# Altium schematic sheet BlindZer_Sche.SchDoc: BlindZer
size A; DrawnBy: Can Chen; Revision: -; SheetNumber: 1; SheetTotal: 1
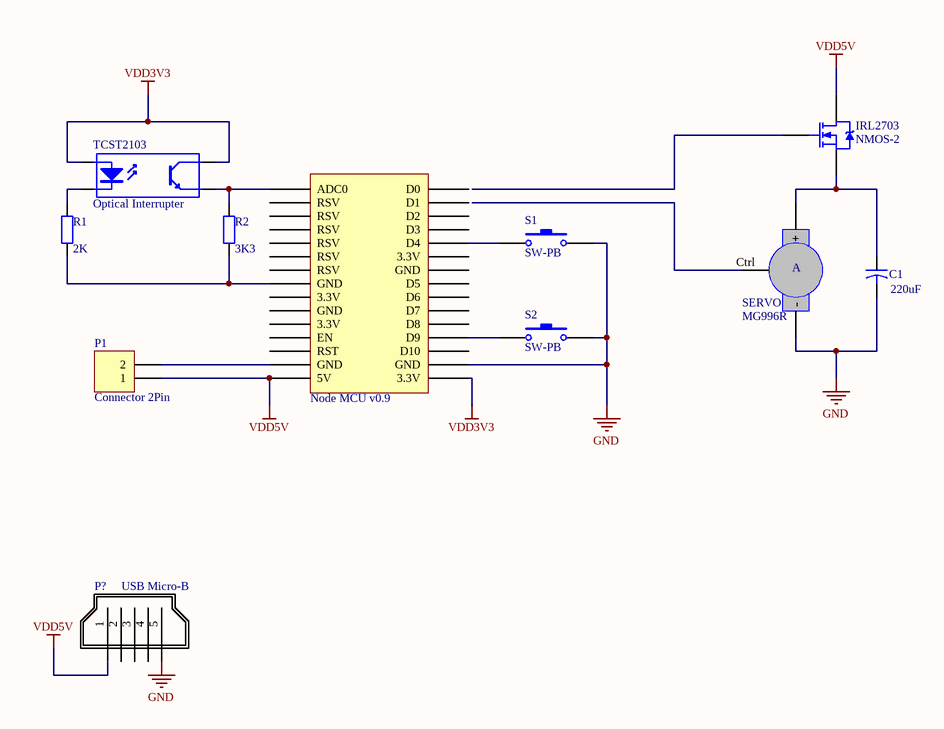
[diagram p0: BlindZer_Sche.SchDoc]

## Parts
*  Node MCU v0.9
C1  value 220uF  [CAPR5-4X5]  (hidden comment: Cap2)
IRL2703  NMOS-2  [TO-220AB]
MG996R  SERVO
P1  Connector 2Pin  [HDR1X2]
P?  USB Micro-B
R1  value 2K  [AXIAL-0.4]  (hidden comment: Res2)
R2  value 3K3  [AXIAL-0.4]  (hidden comment: Res2)
S1  SW-PB  [SPST-2]
S2  SW-PB  [SPST-2]
TCST2103  Optical Interrupter  [DIP-4]

## Nets
GND: *.GND C1.2 MG996R.- P?.5(GND) S1.2 S2.2
VDD3V3: *.3.3V TCST2103.1(A) TCST2103.4(C)
VDD5V: *.5V IRL2703.2(D) P1.1 P?.1(Vcc)
Net*_ADC0: *.ADC0 R2.2 TCST2103.3(E)
Net*_D4: *.D4 S1.1
Net*_D9: *.D9 S2.1
Net*_GND: *.GND P1.2
Net*_GND: *.GND R1.1 R2.1  [a separate net that carries the same name]
NetC1_1: C1.1 IRL2703.3(S) MG996R.+
NetR1_2: R1.2 TCST2103.2(K)

Not connected (* = marked no-connect by the designer): * D0 D1 D2 D3 D5 D6 D7 D8 D10 EN NC(RSV) RST; IRL2703 1(G); MG996R Ctrl; P? 2(D-) 3(D+) 4(Sense)

## Notes on the sheet
- (in symbol Servo_3Terminals) A

## Library data of the parts
C1 = Cap2: Capacitor; Published: 23-Sep-2002; PackageReference: CAPR5-4X5; Publisher: Altium Limited; PackageDescription: Capacitor; 2 Leads
IRL2703 = NMOS-2: N-Channel Power MOSFET; Note: Pin 2 is electrically connected to pin 4.; Published: 8-Jun-2000; LatestRevisionDate: 17-Jul-2002; LatestRevisionNote: Re-released for DXP Platform.; DatasheetVersion: PD-9.814; PackageVersion: Feb-1997; PackageReference: TO-220AB; Publisher: Altium Limited; PackageDescription: TO, Thru-Hole, Vertical, Heatsink Mounted; 3 In-Line Leads; Pitch 2.54 mm; ComponentLink1Description: Manufacturer Link; ComponentLink1URL: http://www.irf.com/
MG996R = Servo_3Terminals
P1 = Header 2: Header, 2-Pin; LatestRevisionDate: 17-Jul-2002; LatestRevisionNote: Re-released for DXP Platform.; Publisher: Altium Limited
R1 R2 = Res2: Resistor; Published: 8-Jun-2000; LatestRevisionDate: 17-Jul-2002; LatestRevisionNote: Re-released for DXP Platform.; PackageReference: AXIAL-0.4; Publisher: Altium Limited; PackageDescription: Axial Device, Thru-Hole; 2 Leads; 0.4 in Pin Spacing
S1 S2 = SW-PB: Switch; Published: 24-Mar-1999; LatestRevisionDate: 17-Jul-2002; LatestRevisionNote: Re-released for DXP Platform.; PackageReference: SPST-2; Publisher: Altium Limited; PackageDescription: Switch; 2 Leads
TCST2103 = Optoisolator1: 4-Pin Phototransistor Optocoupler; Published: 24-Mar-1999; LatestRevisionDate: 04-Mar-2005; LatestRevisionNote: Sch pins 3 & 4 Swapped.; DatasheetVersion: Nov-2003; PackageReference: DIP-4; Publisher: Altium Limited